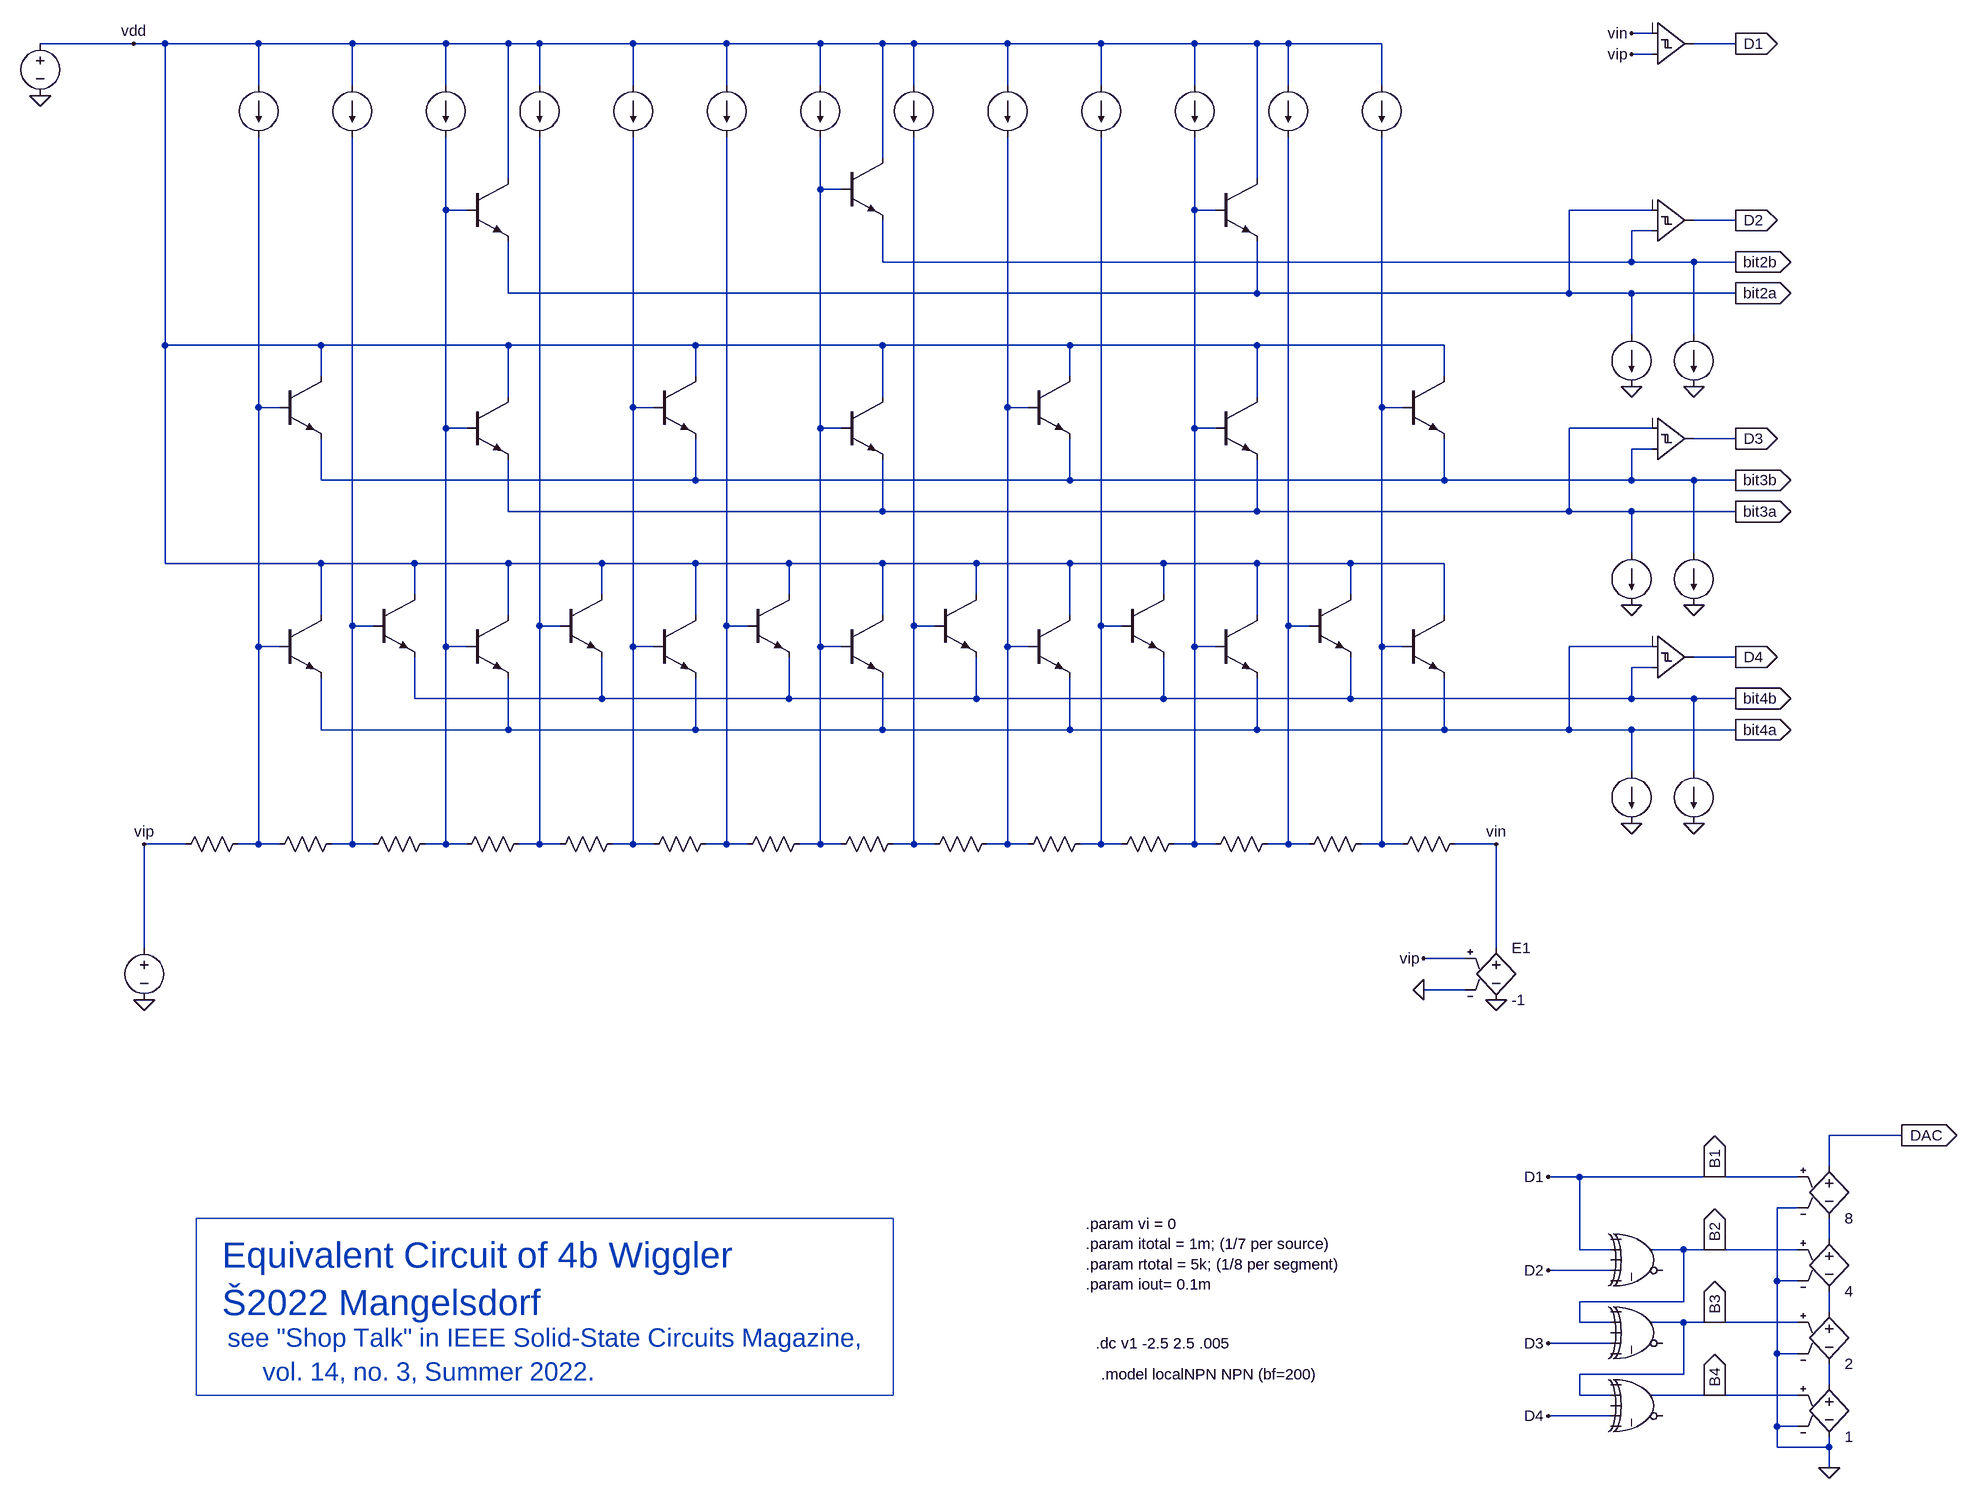
[diagram p0: schematic four_bit_wiggler.asc]
four_bit_wiggler.asc, the LTspice schematic file:
Version 4
SHEET 1 1468 2148
WIRE 960 -80 928 -80
WIRE -1376 -64 -1520 -64
WIRE -1328 -64 -1376 -64
WIRE -1184 -64 -1328 -64
WIRE -1040 -64 -1184 -64
WIRE -896 -64 -1040 -64
WIRE -800 -64 -896 -64
WIRE -752 -64 -800 -64
WIRE -608 -64 -752 -64
WIRE -464 -64 -608 -64
WIRE -320 -64 -464 -64
WIRE -224 -64 -320 -64
WIRE -176 -64 -224 -64
WIRE -32 -64 -176 -64
WIRE 112 -64 -32 -64
WIRE 256 -64 112 -64
WIRE 352 -64 256 -64
WIRE 400 -64 352 -64
WIRE 544 -64 400 -64
WIRE 1088 -64 1024 -64
WIRE 960 -48 928 -48
WIRE -1184 0 -1184 -64
WIRE -1040 0 -1040 -64
WIRE -896 0 -896 -64
WIRE -752 0 -752 -64
WIRE -608 0 -608 -64
WIRE -464 0 -464 -64
WIRE -320 0 -320 -64
WIRE -176 0 -176 -64
WIRE -32 0 -32 -64
WIRE 112 0 112 -64
WIRE 256 0 256 -64
WIRE 400 0 400 -64
WIRE 544 0 544 -64
WIRE -224 112 -224 -64
WIRE -800 144 -800 -64
WIRE 352 144 352 -64
WIRE -320 160 -320 80
WIRE -288 160 -320 160
WIRE -896 192 -896 80
WIRE -864 192 -896 192
WIRE 256 192 256 80
WIRE 288 192 256 192
WIRE 960 192 832 192
WIRE 1088 208 1024 208
WIRE 960 224 928 224
WIRE -224 272 -224 208
WIRE 928 272 928 224
WIRE 928 272 -224 272
WIRE 1024 272 928 272
WIRE 1088 272 1024 272
WIRE -800 320 -800 240
WIRE 352 320 352 240
WIRE 352 320 -800 320
WIRE 832 320 832 192
WIRE 832 320 352 320
WIRE 928 320 832 320
WIRE 1088 320 928 320
WIRE 928 384 928 320
WIRE 1024 384 1024 272
WIRE -1328 400 -1328 -64
WIRE -1088 400 -1328 400
WIRE -800 400 -1088 400
WIRE -512 400 -800 400
WIRE -224 400 -512 400
WIRE 64 400 -224 400
WIRE 352 400 64 400
WIRE 640 400 352 400
WIRE -1088 448 -1088 400
WIRE -512 448 -512 400
WIRE 64 448 64 400
WIRE 640 448 640 400
WIRE -800 480 -800 400
WIRE -224 480 -224 400
WIRE 352 480 352 400
WIRE -1184 496 -1184 80
WIRE -1152 496 -1184 496
WIRE -608 496 -608 80
WIRE -576 496 -608 496
WIRE -32 496 -32 80
WIRE 0 496 -32 496
WIRE 544 496 544 80
WIRE 576 496 544 496
WIRE -896 528 -896 192
WIRE -864 528 -896 528
WIRE -320 528 -320 160
WIRE -288 528 -320 528
WIRE 256 528 256 192
WIRE 288 528 256 528
WIRE 960 528 832 528
WIRE 1088 544 1024 544
WIRE 960 560 928 560
WIRE -1088 608 -1088 544
WIRE -512 608 -512 544
WIRE -512 608 -1088 608
WIRE 64 608 64 544
WIRE 64 608 -512 608
WIRE 640 608 640 544
WIRE 640 608 64 608
WIRE 928 608 928 560
WIRE 928 608 640 608
WIRE 1024 608 928 608
WIRE 1088 608 1024 608
WIRE -800 656 -800 576
WIRE -224 656 -224 576
WIRE -224 656 -800 656
WIRE 352 656 352 576
WIRE 352 656 -224 656
WIRE 832 656 832 528
WIRE 832 656 352 656
WIRE 928 656 832 656
WIRE 1088 656 928 656
WIRE 928 720 928 656
WIRE 1024 720 1024 608
WIRE -1328 736 -1328 400
WIRE -1088 736 -1328 736
WIRE -944 736 -1088 736
WIRE -800 736 -944 736
WIRE -656 736 -800 736
WIRE -512 736 -656 736
WIRE -368 736 -512 736
WIRE -224 736 -368 736
WIRE -80 736 -224 736
WIRE 64 736 -80 736
WIRE 208 736 64 736
WIRE 352 736 208 736
WIRE 496 736 352 736
WIRE 640 736 496 736
WIRE -944 784 -944 736
WIRE -656 784 -656 736
WIRE -368 784 -368 736
WIRE -80 784 -80 736
WIRE 208 784 208 736
WIRE 496 784 496 736
WIRE -1088 816 -1088 736
WIRE -800 816 -800 736
WIRE -512 816 -512 736
WIRE -224 816 -224 736
WIRE 64 816 64 736
WIRE 352 816 352 736
WIRE 640 816 640 736
WIRE -1040 832 -1040 80
WIRE -1008 832 -1040 832
WIRE -752 832 -752 80
WIRE -720 832 -752 832
WIRE -464 832 -464 80
WIRE -432 832 -464 832
WIRE -176 832 -176 80
WIRE -144 832 -176 832
WIRE 112 832 112 80
WIRE 144 832 112 832
WIRE 400 832 400 80
WIRE 432 832 400 832
WIRE -1184 864 -1184 496
WIRE -1152 864 -1184 864
WIRE -896 864 -896 528
WIRE -864 864 -896 864
WIRE -608 864 -608 496
WIRE -576 864 -608 864
WIRE -320 864 -320 528
WIRE -288 864 -320 864
WIRE -32 864 -32 496
WIRE 0 864 -32 864
WIRE 256 864 256 528
WIRE 288 864 256 864
WIRE 544 864 544 496
WIRE 576 864 544 864
WIRE 960 864 832 864
WIRE 1088 880 1024 880
WIRE 960 896 928 896
WIRE -944 944 -944 880
WIRE -656 944 -656 880
WIRE -656 944 -944 944
WIRE -368 944 -368 880
WIRE -368 944 -656 944
WIRE -80 944 -80 880
WIRE -80 944 -368 944
WIRE 208 944 208 880
WIRE 208 944 -80 944
WIRE 496 944 496 880
WIRE 496 944 208 944
WIRE 928 944 928 896
WIRE 928 944 496 944
WIRE 1024 944 928 944
WIRE 1088 944 1024 944
WIRE -1088 992 -1088 912
WIRE -800 992 -800 912
WIRE -800 992 -1088 992
WIRE -512 992 -512 912
WIRE -512 992 -800 992
WIRE -224 992 -224 912
WIRE -224 992 -512 992
WIRE 64 992 64 912
WIRE 64 992 -224 992
WIRE 352 992 352 912
WIRE 352 992 64 992
WIRE 640 992 640 912
WIRE 640 992 352 992
WIRE 832 992 832 864
WIRE 832 992 640 992
WIRE 928 992 832 992
WIRE 1088 992 928 992
WIRE 928 1056 928 992
WIRE 1024 1056 1024 944
WIRE -1296 1168 -1360 1168
WIRE -1184 1168 -1184 864
WIRE -1184 1168 -1216 1168
WIRE -1152 1168 -1184 1168
WIRE -1040 1168 -1040 832
WIRE -1040 1168 -1072 1168
WIRE -1008 1168 -1040 1168
WIRE -896 1168 -896 864
WIRE -896 1168 -928 1168
WIRE -864 1168 -896 1168
WIRE -752 1168 -752 832
WIRE -752 1168 -784 1168
WIRE -720 1168 -752 1168
WIRE -608 1168 -608 864
WIRE -608 1168 -640 1168
WIRE -576 1168 -608 1168
WIRE -464 1168 -464 832
WIRE -464 1168 -496 1168
WIRE -432 1168 -464 1168
WIRE -320 1168 -320 864
WIRE -320 1168 -352 1168
WIRE -288 1168 -320 1168
WIRE -176 1168 -176 832
WIRE -176 1168 -208 1168
WIRE -144 1168 -176 1168
WIRE -32 1168 -32 864
WIRE -32 1168 -64 1168
WIRE 0 1168 -32 1168
WIRE 112 1168 112 832
WIRE 112 1168 80 1168
WIRE 144 1168 112 1168
WIRE 256 1168 256 864
WIRE 256 1168 224 1168
WIRE 288 1168 256 1168
WIRE 400 1168 400 832
WIRE 400 1168 368 1168
WIRE 432 1168 400 1168
WIRE 544 1168 544 864
WIRE 544 1168 512 1168
WIRE 576 1168 544 1168
WIRE 720 1168 656 1168
WIRE -1360 1328 -1360 1168
WIRE 720 1328 720 1168
WIRE 672 1344 608 1344
WIRE 672 1392 608 1392
WIRE 1344 1616 1232 1616
WIRE 1232 1664 1232 1616
WIRE 848 1680 800 1680
WIRE 1056 1680 848 1680
WIRE 1184 1680 1056 1680
WIRE 1184 1728 1152 1728
WIRE 1232 1776 1232 1744
WIRE 848 1792 848 1680
WIRE 896 1792 848 1792
WIRE 1008 1792 960 1792
WIRE 1056 1792 1008 1792
WIRE 1184 1792 1056 1792
WIRE 896 1824 800 1824
WIRE 1152 1840 1152 1728
WIRE 1184 1840 1152 1840
WIRE 1008 1872 1008 1792
WIRE 1008 1872 848 1872
WIRE 1232 1888 1232 1856
WIRE 848 1904 848 1872
WIRE 896 1904 848 1904
WIRE 1008 1904 960 1904
WIRE 1056 1904 1008 1904
WIRE 1184 1904 1056 1904
WIRE 896 1936 800 1936
WIRE 1152 1952 1152 1840
WIRE 1184 1952 1152 1952
WIRE 1008 1984 1008 1904
WIRE 1008 1984 848 1984
WIRE 1232 2000 1232 1968
WIRE 848 2016 848 1984
WIRE 896 2016 848 2016
WIRE 1056 2016 960 2016
WIRE 1184 2016 1056 2016
WIRE 896 2048 800 2048
WIRE 1152 2064 1152 1952
WIRE 1184 2064 1152 2064
WIRE 1152 2096 1152 2064
WIRE 1232 2096 1232 2080
WIRE 1232 2096 1152 2096
WIRE 1232 2128 1232 2096
FLAG -1360 1408 0
FLAG 720 1408 0
FLAG -1520 16 0
FLAG 928 464 0
FLAG 1024 464 0
FLAG 1088 272 bit2b
IOPIN 1088 272 Out
FLAG 1088 320 bit2a
IOPIN 1088 320 Out
FLAG -1376 -64 vdd
FLAG -1360 1168 vip
FLAG 608 1344 vip
FLAG 608 1392 0
FLAG 928 800 0
FLAG 1024 800 0
FLAG 1088 608 bit3b
IOPIN 1088 608 Out
FLAG 1088 656 bit3a
IOPIN 1088 656 Out
FLAG 928 1136 0
FLAG 1024 1136 0
FLAG 1088 944 bit4b
IOPIN 1088 944 Out
FLAG 1088 992 bit4a
IOPIN 1088 992 Out
FLAG 1088 544 D3
IOPIN 1088 544 Out
FLAG 1088 880 D4
IOPIN 1088 880 Out
FLAG 1088 208 D2
IOPIN 1088 208 Out
FLAG 720 1168 vin
FLAG 1088 -64 D1
IOPIN 1088 -64 Out
FLAG 928 -80 vin
FLAG 928 -48 vip
FLAG 1056 1792 B2
IOPIN 1056 1792 Out
FLAG 1056 1904 B3
IOPIN 1056 1904 Out
FLAG 1056 2016 B4
IOPIN 1056 2016 Out
FLAG 1056 1680 B1
IOPIN 1056 1680 Out
FLAG 800 1680 D1
FLAG 800 1824 D2
FLAG 800 1936 D3
FLAG 800 2048 D4
FLAG 1344 1616 DAC
IOPIN 1344 1616 Out
FLAG 1232 2128 0
SYMBOL current -1184 0 R0
WINDOW 0 -149 -374 Invisible 2
WINDOW 3 -181 -356 Invisible 2
WINDOW 123 0 0 Left 0
WINDOW 39 0 0 Left 0
SYMATTR InstName I16
SYMATTR Value {itotal/7}
SYMBOL res -1200 1152 R90
WINDOW 0 -776 88 Invisible 2
WINDOW 3 -835 55 Invisible 2
SYMATTR InstName R13
SYMATTR Value {rtotal/8}
SYMBOL res -1056 1152 R90
WINDOW 0 -776 88 Invisible 2
WINDOW 3 -835 55 Invisible 2
SYMATTR InstName R1
SYMATTR Value {rtotal/8}
SYMBOL res -912 1152 R90
WINDOW 0 -776 88 Invisible 2
WINDOW 3 -835 55 Invisible 2
SYMATTR InstName R2
SYMATTR Value {rtotal/8}
SYMBOL res 672 1152 R90
WINDOW 0 -776 88 Invisible 2
WINDOW 3 -835 55 Invisible 2
SYMATTR InstName R14
SYMATTR Value {rtotal/8}
SYMBOL voltage -1360 1312 R0
WINDOW 0 -20 -727 Invisible 2
WINDOW 3 46 -731 Invisible 2
SYMATTR InstName V1
SYMATTR Value {vi/2}
SYMBOL voltage -1520 -80 R0
WINDOW 0 -18 -150 Invisible 2
WINDOW 3 63 -167 Invisible 2
SYMATTR InstName V3
SYMATTR Value 10
SYMBOL current 928 384 R0
WINDOW 0 -149 -760 Invisible 2
WINDOW 3 -251 -756 Invisible 2
SYMATTR InstName I13
SYMATTR Value {iout}
SYMBOL current 1024 384 R0
WINDOW 0 -149 -760 Invisible 2
WINDOW 3 -251 -756 Invisible 2
SYMATTR InstName I14
SYMATTR Value {iout}
SYMBOL e 720 1312 R0
SYMATTR InstName E1
SYMATTR Value -1
SYMBOL res -768 1152 R90
WINDOW 0 -776 88 Invisible 2
WINDOW 3 -835 55 Invisible 2
SYMATTR InstName R3
SYMATTR Value {rtotal/8}
SYMBOL res -624 1152 R90
WINDOW 0 -776 88 Invisible 2
WINDOW 3 -835 55 Invisible 2
SYMATTR InstName R4
SYMATTR Value {rtotal/8}
SYMBOL npn -864 144 R0
WINDOW 0 51 -456 Invisible 2
WINDOW 3 60 -433 Invisible 2
SYMATTR InstName Q2
SYMATTR Value localNPN
SYMBOL res -480 1152 R90
WINDOW 0 -776 88 Invisible 2
WINDOW 3 -835 55 Invisible 2
SYMATTR InstName R5
SYMATTR Value {rtotal/8}
SYMBOL res -336 1152 R90
WINDOW 0 -776 88 Invisible 2
WINDOW 3 -835 55 Invisible 2
SYMATTR InstName R6
SYMATTR Value {rtotal/8}
SYMBOL res -192 1152 R90
WINDOW 0 -776 88 Invisible 2
WINDOW 3 -835 55 Invisible 2
SYMATTR InstName R7
SYMATTR Value {rtotal/8}
SYMBOL res -48 1152 R90
WINDOW 0 -776 88 Invisible 2
WINDOW 3 -835 55 Invisible 2
SYMATTR InstName R8
SYMATTR Value {rtotal/8}
SYMBOL res 96 1152 R90
WINDOW 0 -776 88 Invisible 2
WINDOW 3 -835 55 Invisible 2
SYMATTR InstName R9
SYMATTR Value {rtotal/8}
SYMBOL res 240 1152 R90
WINDOW 0 -776 88 Invisible 2
WINDOW 3 -835 55 Invisible 2
SYMATTR InstName R10
SYMATTR Value {rtotal/8}
SYMBOL res 384 1152 R90
WINDOW 0 -776 88 Invisible 2
WINDOW 3 -835 55 Invisible 2
SYMATTR InstName R11
SYMATTR Value {rtotal/8}
SYMBOL res 528 1152 R90
WINDOW 0 -776 88 Invisible 2
WINDOW 3 -835 55 Invisible 2
SYMATTR InstName R12
SYMATTR Value {rtotal/8}
SYMBOL npn 288 144 R0
WINDOW 0 51 -456 Invisible 2
WINDOW 3 60 -433 Invisible 2
SYMATTR InstName Q10
SYMATTR Value localNPN
SYMBOL current 928 720 R0
WINDOW 0 -149 -760 Invisible 2
WINDOW 3 -251 -756 Invisible 2
SYMATTR InstName I15
SYMATTR Value {iout}
SYMBOL current 1024 720 R0
WINDOW 0 -149 -760 Invisible 2
WINDOW 3 -251 -756 Invisible 2
SYMATTR InstName I17
SYMATTR Value {iout}
SYMBOL npn -1152 816 R0
WINDOW 0 51 -456 Invisible 2
WINDOW 3 60 -433 Invisible 2
SYMATTR InstName Q27
SYMATTR Value localNPN
SYMBOL npn -1008 784 R0
WINDOW 0 51 -456 Invisible 2
WINDOW 3 60 -433 Invisible 2
SYMATTR InstName Q28
SYMATTR Value localNPN
SYMBOL npn -864 816 R0
WINDOW 0 51 -456 Invisible 2
WINDOW 3 60 -433 Invisible 2
SYMATTR InstName Q29
SYMATTR Value localNPN
SYMBOL npn -720 784 R0
WINDOW 0 51 -456 Invisible 2
WINDOW 3 60 -433 Invisible 2
SYMATTR InstName Q30
SYMATTR Value localNPN
SYMBOL npn -576 816 R0
WINDOW 0 51 -456 Invisible 2
WINDOW 3 60 -433 Invisible 2
SYMATTR InstName Q31
SYMATTR Value localNPN
SYMBOL npn -432 784 R0
WINDOW 0 51 -456 Invisible 2
WINDOW 3 60 -433 Invisible 2
SYMATTR InstName Q32
SYMATTR Value localNPN
SYMBOL npn -288 816 R0
WINDOW 0 51 -456 Invisible 2
WINDOW 3 60 -433 Invisible 2
SYMATTR InstName Q33
SYMATTR Value localNPN
SYMBOL npn -144 784 R0
WINDOW 0 51 -456 Invisible 2
WINDOW 3 60 -433 Invisible 2
SYMATTR InstName Q34
SYMATTR Value localNPN
SYMBOL npn 0 816 R0
WINDOW 0 51 -456 Invisible 2
WINDOW 3 60 -433 Invisible 2
SYMATTR InstName Q35
SYMATTR Value localNPN
SYMBOL npn 144 784 R0
WINDOW 0 51 -456 Invisible 2
WINDOW 3 60 -433 Invisible 2
SYMATTR InstName Q36
SYMATTR Value localNPN
SYMBOL npn 288 816 R0
WINDOW 0 51 -456 Invisible 2
WINDOW 3 60 -433 Invisible 2
SYMATTR InstName Q37
SYMATTR Value localNPN
SYMBOL npn 432 784 R0
WINDOW 0 51 -456 Invisible 2
WINDOW 3 60 -433 Invisible 2
SYMATTR InstName Q38
SYMATTR Value localNPN
SYMBOL npn 576 816 R0
WINDOW 0 51 -456 Invisible 2
WINDOW 3 60 -433 Invisible 2
SYMATTR InstName Q39
SYMATTR Value localNPN
SYMBOL current 928 1056 R0
WINDOW 0 -149 -760 Invisible 2
WINDOW 3 -251 -756 Invisible 2
SYMATTR InstName I18
SYMATTR Value {iout}
SYMBOL current 1024 1056 R0
WINDOW 0 -149 -760 Invisible 2
WINDOW 3 -251 -756 Invisible 2
SYMATTR InstName I19
SYMATTR Value {iout}
SYMBOL npn -864 480 R0
WINDOW 0 51 -456 Invisible 2
WINDOW 3 60 -433 Invisible 2
SYMATTR InstName Q15
SYMATTR Value localNPN
SYMBOL npn -288 480 R0
WINDOW 0 51 -456 Invisible 2
WINDOW 3 60 -433 Invisible 2
SYMATTR InstName Q18
SYMATTR Value localNPN
SYMBOL npn 288 480 R0
WINDOW 0 51 -456 Invisible 2
WINDOW 3 60 -433 Invisible 2
SYMATTR InstName Q20
SYMATTR Value localNPN
SYMBOL Digital\\diffschmtbuf 960 608 M180
WINDOW 0 8 16 Invisible 2
WINDOW 3 8 44 Invisible 2
SYMATTR InstName A2
SYMATTR Value vt=0 vh=0
SYMBOL Digital\\diffschmtbuf 960 944 M180
WINDOW 0 8 16 Invisible 2
WINDOW 3 8 44 Invisible 2
SYMATTR InstName A1
SYMATTR Value vt=0 vh=0
SYMBOL Digital\\diffschmtbuf 960 272 M180
WINDOW 0 8 16 Invisible 2
WINDOW 3 8 44 Invisible 2
SYMATTR InstName A3
SYMATTR Value vt=0 vh=0
SYMBOL Digital\\diffschmtbuf 960 0 M180
WINDOW 0 8 16 Invisible 2
WINDOW 3 8 44 Invisible 2
SYMATTR InstName A4
SYMATTR Value vt=0 vh=0
SYMBOL Digital\\xor 944 1744 R0
WINDOW 0 16 24 Invisible 2
WINDOW 3 16 52 Invisible 2
SYMATTR InstName A5
SYMATTR Value vt=0.5
SYMBOL Digital\\xor 944 1856 R0
WINDOW 0 16 24 Invisible 2
WINDOW 3 16 52 Invisible 2
SYMATTR InstName A6
SYMATTR Value vt=0.5
SYMBOL Digital\\xor 944 1968 R0
WINDOW 0 16 24 Invisible 2
WINDOW 3 16 52 Invisible 2
SYMATTR InstName A7
SYMATTR Value vt=0.5
SYMBOL e 1232 1984 R0
WINDOW 0 24 16 Invisible 2
SYMATTR InstName E2
SYMATTR Value 1
SYMBOL e 1232 1872 R0
WINDOW 0 24 16 Invisible 2
SYMATTR InstName E3
SYMATTR Value 2
SYMBOL e 1232 1760 R0
WINDOW 0 24 16 Invisible 2
SYMATTR InstName E4
SYMATTR Value 4
SYMBOL e 1232 1648 R0
WINDOW 0 24 16 Invisible 2
SYMATTR InstName E5
SYMATTR Value 8
SYMBOL current -1040 0 R0
WINDOW 0 -149 -374 Invisible 2
WINDOW 3 -181 -356 Invisible 2
WINDOW 123 0 0 Left 0
WINDOW 39 0 0 Left 0
SYMATTR InstName I1
SYMATTR Value {itotal/7}
SYMBOL current -896 0 R0
WINDOW 0 -149 -374 Invisible 2
WINDOW 3 -181 -356 Invisible 2
WINDOW 123 0 0 Left 0
WINDOW 39 0 0 Left 0
SYMATTR InstName I2
SYMATTR Value {itotal/7}
SYMBOL current -752 0 R0
WINDOW 0 -149 -374 Invisible 2
WINDOW 3 -181 -356 Invisible 2
WINDOW 123 0 0 Left 0
WINDOW 39 0 0 Left 0
SYMATTR InstName I3
SYMATTR Value {itotal/7}
SYMBOL current -608 0 R0
WINDOW 0 -149 -374 Invisible 2
WINDOW 3 -181 -356 Invisible 2
WINDOW 123 0 0 Left 0
WINDOW 39 0 0 Left 0
SYMATTR InstName I4
SYMATTR Value {itotal/7}
SYMBOL current -464 0 R0
WINDOW 0 -149 -374 Invisible 2
WINDOW 3 -181 -356 Invisible 2
WINDOW 123 0 0 Left 0
WINDOW 39 0 0 Left 0
SYMATTR InstName I5
SYMATTR Value {itotal/7}
SYMBOL current -320 0 R0
WINDOW 0 -149 -374 Invisible 2
WINDOW 3 -181 -356 Invisible 2
WINDOW 123 0 0 Left 0
WINDOW 39 0 0 Left 0
SYMATTR InstName I6
SYMATTR Value {itotal/7}
SYMBOL current -176 0 R0
WINDOW 0 -149 -374 Invisible 2
WINDOW 3 -181 -356 Invisible 2
WINDOW 123 0 0 Left 0
WINDOW 39 0 0 Left 0
SYMATTR InstName I7
SYMATTR Value {itotal/7}
SYMBOL current -32 0 R0
WINDOW 0 -149 -374 Invisible 2
WINDOW 3 -181 -356 Invisible 2
WINDOW 123 0 0 Left 0
WINDOW 39 0 0 Left 0
SYMATTR InstName I8
SYMATTR Value {itotal/7}
SYMBOL current 112 0 R0
WINDOW 0 -149 -374 Invisible 2
WINDOW 3 -181 -356 Invisible 2
WINDOW 123 0 0 Left 0
WINDOW 39 0 0 Left 0
SYMATTR InstName I9
SYMATTR Value {itotal/7}
SYMBOL current 256 0 R0
WINDOW 0 -149 -374 Invisible 2
WINDOW 3 -181 -356 Invisible 2
WINDOW 123 0 0 Left 0
WINDOW 39 0 0 Left 0
SYMATTR InstName I10
SYMATTR Value {itotal/7}
SYMBOL current 400 0 R0
WINDOW 0 -149 -374 Invisible 2
WINDOW 3 -181 -356 Invisible 2
WINDOW 123 0 0 Left 0
WINDOW 39 0 0 Left 0
SYMATTR InstName I11
SYMATTR Value {itotal/7}
SYMBOL current 544 0 R0
WINDOW 0 -149 -374 Invisible 2
WINDOW 3 -181 -356 Invisible 2
WINDOW 123 0 0 Left 0
WINDOW 39 0 0 Left 0
SYMATTR InstName I12
SYMATTR Value {itotal/7}
SYMBOL npn -1152 448 R0
WINDOW 0 51 -456 Invisible 2
WINDOW 3 60 -433 Invisible 2
SYMATTR InstName Q3
SYMATTR Value localNPN
SYMBOL npn -576 448 R0
WINDOW 0 51 -456 Invisible 2
WINDOW 3 60 -433 Invisible 2
SYMATTR InstName Q4
SYMATTR Value localNPN
SYMBOL npn 0 448 R0
WINDOW 0 51 -456 Invisible 2
WINDOW 3 60 -433 Invisible 2
SYMATTR InstName Q5
SYMATTR Value localNPN
SYMBOL npn 576 448 R0
WINDOW 0 51 -456 Invisible 2
WINDOW 3 60 -433 Invisible 2
SYMATTR InstName Q1
SYMATTR Value localNPN
SYMBOL npn -288 112 R0
WINDOW 0 51 -456 Invisible 2
WINDOW 3 60 -433 Invisible 2
SYMATTR InstName Q6
SYMATTR Value localNPN
TEXT 88 1752 Left 2 !.param vi = 0\n.param itotal = 1m; (1/7 per source)\n.param rtotal = 5k; (1/8 per segment)\n.param iout= 0.1m
TEXT 104 1936 Left 2 !.dc v1 -2.5 2.5 .005
TEXT 112 1984 Left 2 !.model localNPN NPN (bf=200)
TEXT -1240 1800 Left 5 ;Equivalent Circuit of 4b Wiggler\nŠ2022 Mangelsdorf
TEXT -1232 1928 Left 4 ;see "Shop Talk" in IEEE Solid-State Circuits Magazine, \n     vol. 14, no. 3, Summer 2022.
RECTANGLE Normal -208 2016 -1280 1744

The netlist it stands for:
* four_bit_wiggler.asc
I16 vdd N004 {itotal/7}
R13 N004 vip {rtotal/8}
R1 N008 N004 {rtotal/8}
R2 N002 N008 {rtotal/8}
R14 vin N007 {rtotal/8}
V1 vip 0 {vi/2}
V3 vdd 0 10
I13 bit2a 0 {iout}
I14 bit2b 0 {iout}
E1 vin 0 vip 0 -1
R3 N009 N002 {rtotal/8}
R4 N005 N009 {rtotal/8}
Q2 vdd N002 bit2a 0 localNPN
R5 N010 N005 {rtotal/8}
R6 N001 N010 {rtotal/8}
R7 N011 N001 {rtotal/8}
R8 N006 N011 {rtotal/8}
R9 N012 N006 {rtotal/8}
R10 N003 N012 {rtotal/8}
R11 N013 N003 {rtotal/8}
R12 N007 N013 {rtotal/8}
Q10 vdd N003 bit2a 0 localNPN
I15 bit3a 0 {iout}
I17 bit3b 0 {iout}
Q27 vdd N004 bit4a 0 localNPN
Q28 vdd N008 bit4b 0 localNPN
Q29 vdd N002 bit4a 0 localNPN
Q30 vdd N009 bit4b 0 localNPN
Q31 vdd N005 bit4a 0 localNPN
Q32 vdd N010 bit4b 0 localNPN
Q33 vdd N001 bit4a 0 localNPN
Q34 vdd N011 bit4b 0 localNPN
Q35 vdd N006 bit4a 0 localNPN
Q36 vdd N012 bit4b 0 localNPN
Q37 vdd N003 bit4a 0 localNPN
Q38 vdd N013 bit4b 0 localNPN
Q39 vdd N007 bit4a 0 localNPN
I18 bit4a 0 {iout}
I19 bit4b 0 {iout}
Q15 vdd N002 bit3a 0 localNPN
Q18 vdd N001 bit3a 0 localNPN
Q20 vdd N003 bit3a 0 localNPN
A2 bit3b bit3a 0 0 0 0 D3 0 SCHMITT vt=0 vh=0
A1 bit4b bit4a 0 0 0 0 D4 0 SCHMITT vt=0 vh=0
A3 bit2b bit2a 0 0 0 0 D2 0 SCHMITT vt=0 vh=0
A4 vip vin 0 0 0 0 B1 0 SCHMITT vt=0 vh=0
A5 0 B1 0 D2 0 0 B2 0 XOR vt=0.5
A6 0 B2 0 D3 0 0 B3 0 XOR vt=0.5
A7 0 B3 0 D4 0 0 B4 0 XOR vt=0.5
E2 N016 0 B4 0 1
E3 N015 N016 B3 0 2
E4 N014 N015 B2 0 4
E5 DAC N014 B1 0 8
I1 vdd N008 {itotal/7}
I2 vdd N002 {itotal/7}
I3 vdd N009 {itotal/7}
I4 vdd N005 {itotal/7}
I5 vdd N010 {itotal/7}
I6 vdd N001 {itotal/7}
I7 vdd N011 {itotal/7}
I8 vdd N006 {itotal/7}
I9 vdd N012 {itotal/7}
I10 vdd N003 {itotal/7}
I11 vdd N013 {itotal/7}
I12 vdd N007 {itotal/7}
Q3 vdd N004 bit3b 0 localNPN
Q4 vdd N005 bit3b 0 localNPN
Q5 vdd N006 bit3b 0 localNPN
Q1 vdd N007 bit3b 0 localNPN
Q6 vdd N001 bit2b 0 localNPN
.model NPN NPN
.model PNP PNP
.lib standard.bjt
.param vi = 0
.param itotal = 1m; (1/7 per source)
.param rtotal = 5k; (1/8 per segment)
.param iout= 0.1m
.dc v1 -2.5 2.5 .005
.model localNPN NPN (bf=200)
* Equivalent Circuit of 4b Wiggler
* Š2022 Mangelsdorf
* see "Shop Talk" in IEEE Solid-State Circuits Magazine,
*      vol. 14, no. 3, Summer 2022.
.backanno
.end